# Altium schematic sheet Top_Overview.SchDoc: <Document>
size Letter; Engineer: <Engineer>; Organization: UPEL; Address1: USU Power Electronics Lab; Address2: USTAR Building 620, RM 118; Address3: 1600 N 620 E; Address4: North Logan, UT 84341; DocumentNumber: 1; Revision: v1; SheetNumber: 1; SheetTotal: 16; ProjectName: <Project>
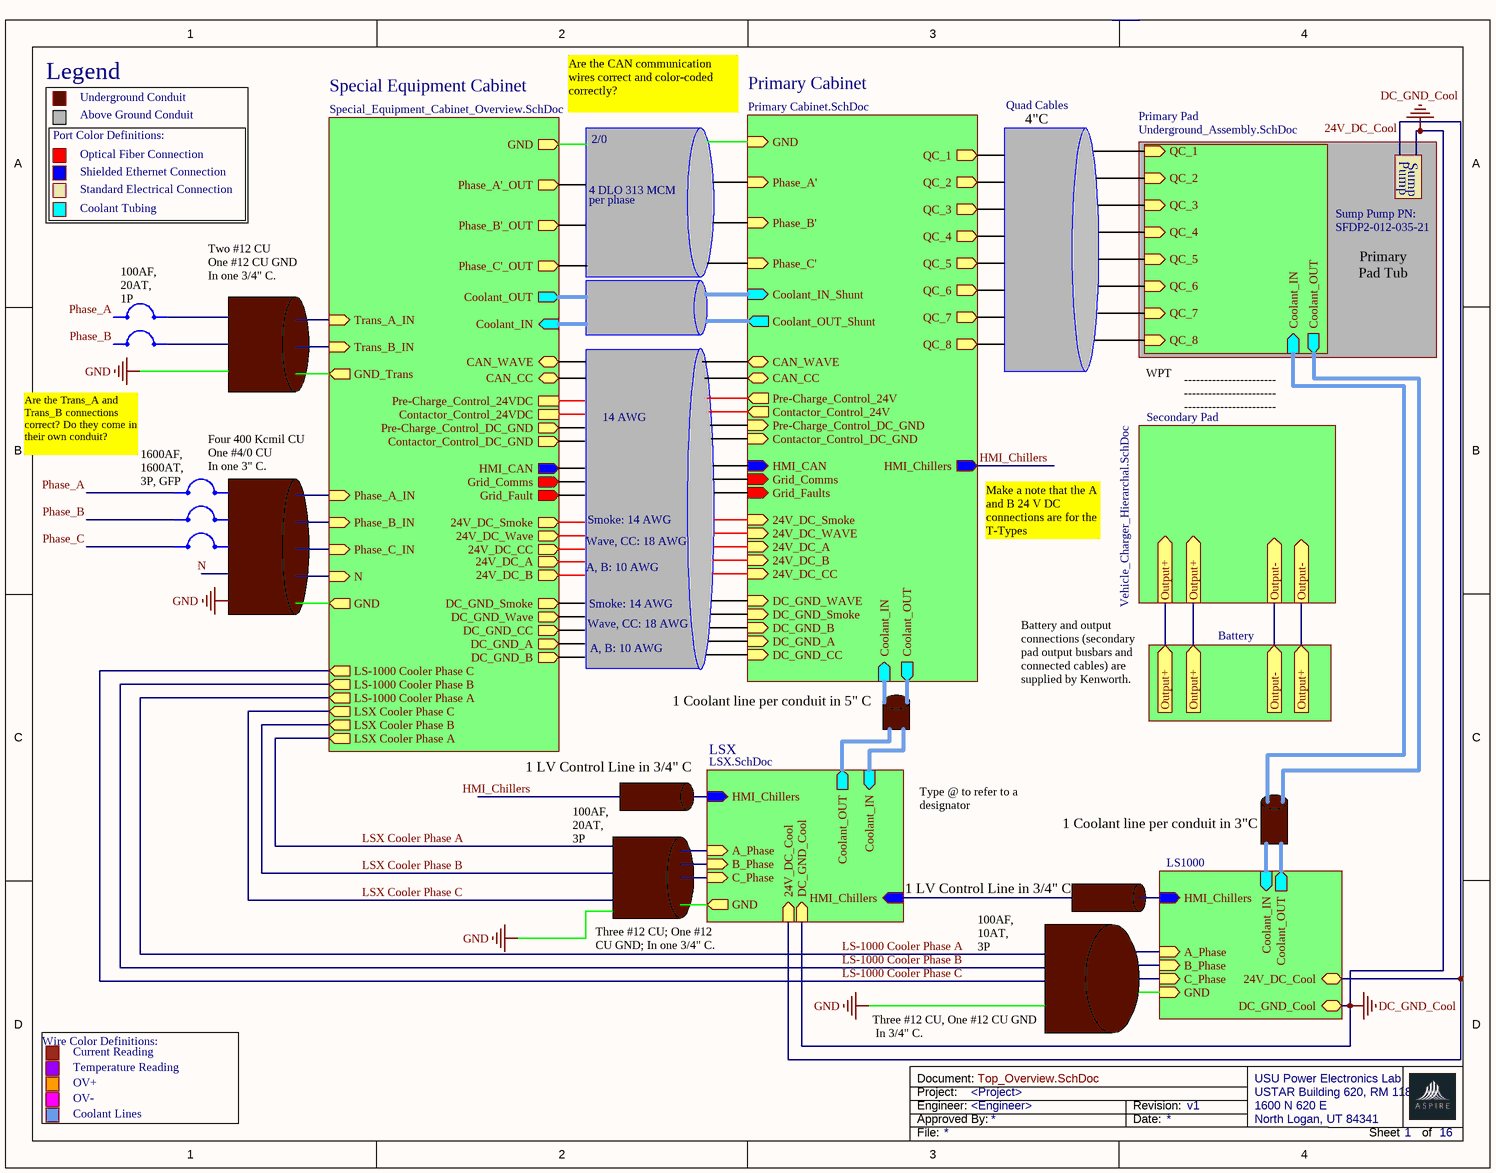
[diagram p0: Top_Overview.SchDoc]

## Parts
B1  Breaker  (value not drawn)
B2  Breaker  (value not drawn)
B3  Breaker  (value not drawn)
B6  Breaker  (value not drawn)
B7  Breaker  (value not drawn)

## Sub-sheets
Designator = File Name: no entries
LS1000 = File Name: A_Phase (in), B_Phase (in), C_Phase (in), GND (in), HMI_Chillers (in), 24V_DC_Cool (bidir), DC_GND_Cool (bidir), Coolant_OUT (out), Coolant_IN (in)
LSX = LSX.SchDoc: A_Phase (in), B_Phase (in), C_Phase (in), GND (out), HMI_Chillers (in), 24V_DC_Cool (in), Coolant_OUT (out), DC_GND_Cool (in), Coolant_IN (in), HMI_Chillers (in)
Primary Cabinet = Primary Cabinet.SchDoc: Phase_A' (in), Phase_B' (in), Phase_C' (in), HMI_CAN (in), Grid_Comms (in), Grid_Faults (in), Coolant_IN (in), Coolant_OUT (out), Coolant_IN_Shunt (in), Coolant_OUT_Shunt (out), QC_2 (out), QC_1 (out), QC_3 (out), QC_6 (out), QC_7 (out), QC_8 (out), QC_5 (out), QC_4 (out), GND (in), Pre-Charge_Control_24V (out), Contactor_Control_24V (out), Contactor_Control_DC_GND (in), Pre-Charge_Control_DC_GND (in), 24V_DC_WAVE (in), DC_GND_WAVE (in), 24V_DC_A (in), 24V_DC_B (in), DC_GND_A (in), DC_GND_B (in), 24V_DC_CC (in), DC_GND_CC (in), HMI_Chillers (out), 24V_DC_Smoke (in), DC_GND_Smoke (in), CAN_WAVE (bidir), CAN_CC (bidir)
Primary Pad = Underground_Assembly.SchDoc: Coolant_OUT (out), Coolant_IN (in), QC_1 (in), QC_2 (in), QC_3 (in), QC_4 (in), QC_5 (in), QC_6 (in), QC_7 (in), QC_8 (in)
Secondary Pad = Vehicle_Charger_Hierarchal.SchDoc: no entries
Special Equipment Cabinet = Special_Equipment_Cabinet_Overview.SchDoc: HMI_CAN (out), GND (out), N (in), Grid_Fault (out), Grid_Comms (out), GND_Trans (out), Coolant_IN (in), Coolant_OUT (out), Phase_A_IN (in), Trans_A_IN (in), Trans_B_IN (in), Phase_B_IN (in), Phase_C_IN (in), Phase_A'_OUT (out), Phase_B'_OUT (out), Phase_C'_OUT (out), GND (out), Contactor_Control_24VDC, Pre-Charge_Control_24VDC, Contactor_Control_DC_GND (out), Pre-Charge_Control_DC_GND (out), 24V_DC_CC (out), 24V_DC_Wave (out), 24V_DC_B (out), 24V_DC_A (out), DC_GND_B (out), DC_GND_A (out), DC_GND_Wave (out), DC_GND_CC (out), 24V_DC_Smoke (out), DC_GND_Smoke (out), LSX Cooler Phase A (out), LSX Cooler Phase B (out), LSX Cooler Phase C (out), LS-1000 Cooler Phase A (out), LS-1000 Cooler Phase B (out), LS-1000 Cooler Phase C (out), CAN_WAVE (bidir), CAN_CC (bidir)

## Ports
Output+ (in), Output+ (out), Output- (in), Output- (out)

## Nets
DC_GND_Cool: sheet LS1000/DC_GND_Cool, sheet LSX/DC_GND_Cool
HMI_Chillers: sheet Primary Cabinet/HMI_Chillers
LS-1000 Cooler Phase A: sheet Special Equipment Cabinet/LS-1000 Cooler Phase A
LS-1000 Cooler Phase B: sheet Special Equipment Cabinet/LS-1000 Cooler Phase B
LS-1000 Cooler Phase C: sheet Special Equipment Cabinet/LS-1000 Cooler Phase C
LSX Cooler Phase A: sheet Special Equipment Cabinet/LSX Cooler Phase A
LSX Cooler Phase B: sheet Special Equipment Cabinet/LSX Cooler Phase B
LSX Cooler Phase C: sheet Special Equipment Cabinet/LSX Cooler Phase C
Output+: port Output+, port Output-
Phase_A: B1.0 B6.0
Phase_B: B2.0 B7.0
Phase_C: B3.0
(unnamed): sheet LS1000/24V_DC_Cool, sheet LSX/24V_DC_Cool

Not connected (* = marked no-connect by the designer): B1 1; B2 1; B3 1; B6 1; B7 1

## Notes on the sheet
- Legend
- Underground Conduit
- Are the CAN communication wires correct and color-coded correctly?
- Quad Cables
- Port Color Definitions:
- Optical Fiber Connection
- Shielded Ethernet Connection
- Above Ground Conduit
- 2/0
- 4"C
- Pump
- Sump
- Standard Electrical Connection
- Coolant Tubing
- 4 DLO 313 MCM
- per phase
- Sump Pump PN: SFDP2-012-035-21
- (near B6) 100AF, 20AT, 1P
- Two #12 CU
  One #12 CU GND
  In one 3/4" C.
- Pad Tub
- Primary
- WPT
- Are the Trans_A and Trans_B connections correct? Do they come in their own conduit?
- 14 AWG
- -----------------------
  -----------------------
  -----------------------
- (near B1) 1600AF, 1600AT, 3P, GFP
- (near B1) Four 400 Kcmil CU
  One #4/0 CU
  In one 3" C.
- Wave, CC: 18 AWG
- A, B: 10 AWG
- Smoke: 14 AWG
- Make a note that the A and B 24 V DC connections are for the T-Types
- Battery
- 1 Coolant line per conduit in 5" C
- Battery and output connections (secondary pad output busbars and connected cables) are supplied by Kenworth.
- 1 LV Control Line in 3/4" C
- 100AF, 20AT, 3P
- Type @ to refer to a designator
- 1 Coolant line per conduit in 3"C
- Three #12 CU; One #12 CU GND; In one 3/4" C.
- 100AF, 10AT, 3P
- Current Reading
- Three #12 CU, One #12 CU GND
  In 3/4" C.
- Wire Color Definitions:
- Coolant Lines
- OV-
- OV+
- Temperature Reading
- Labels drawn without touching a wire or pin: 24V_DC_Cool, GND
- Project:
- Engineer:
- Document:
- Approved By:
- Date:
- Revision:
- File:
- Sheet
- of